# Altium project IOTM222.PrjPcb
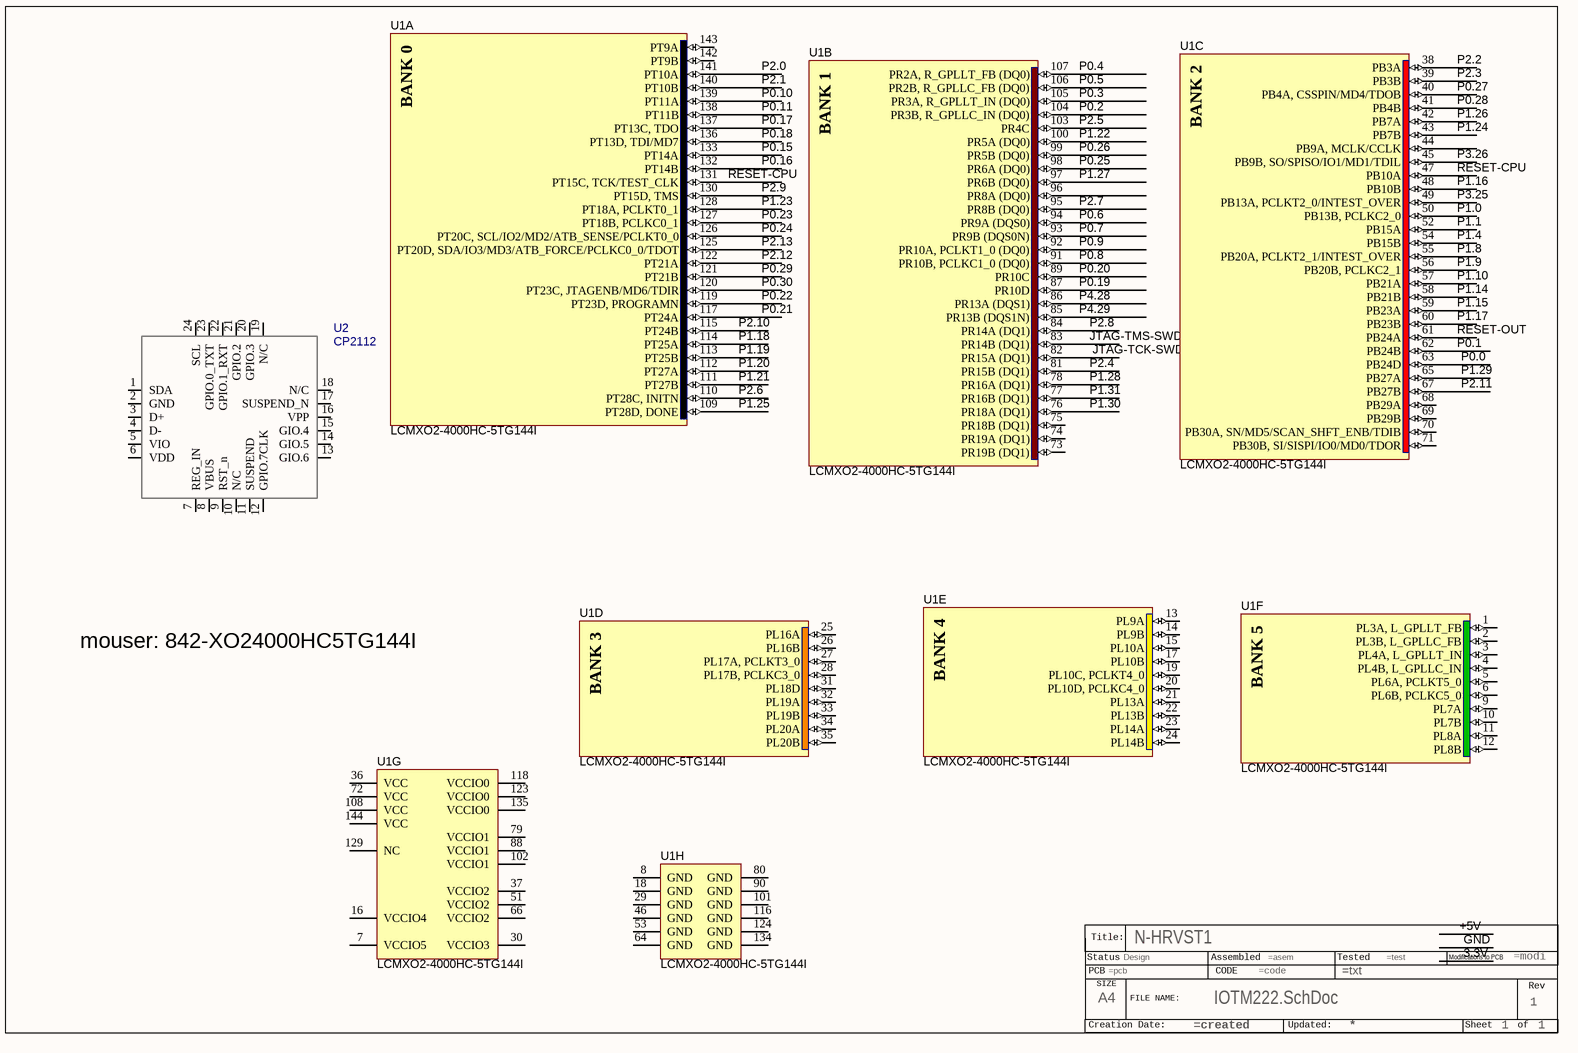
[diagram p0: IOTM222.SchDoc]
prj: N-HRVST1; size: A4; status: Design; ver: 1
2 sheets, 8 parts. Net scope: global (net labels, ports and power ports of the same name join across sheets).
Board file: IOTM222.PcbDoc
Sheets:
  IOTM222.SchDoc
  IOTM-222B.SchDoc

## Sheet IOTM222.SchDoc
size A4; DocumentNumber: 1; SheetNumber: 1; SheetTotal: 1

### Parts
?*  FILE_NAME: IOTM222.SchDoc  PAGE NUMPER: 1  size: A4  pr: N-HRVST1  STATUS: Design  (hidden comment: TITLEBLOCK2)  (graphical)
U1  LCMXO2-4000HC-5TG144I  [TQFP144_N]  (parts A,B,C,D,E,F,G,H of 8)
U2  CP2112  [QFN24]

### Nets
JTAG-TCK-SWDCLK: U1.82(PR15A_(DQ1))
JTAG-TMS-SWDIO: U1.83(PR14B_(DQ1))
P0.0: U1.63(PB24D)
P0.1: U1.62(PB24B)
P0.2: U1.104(PR3B,_R_GPLLC_IN_(DQ0))
P0.3: U1.105(PR3A,_R_GPLLT_IN_(DQ0))
P0.4: U1.107(PR2A,_R_GPLLT_FB_(DQ0))
P0.5: U1.106(PR2B,_R_GPLLC_FB_(DQ0))
P0.6: U1.94(PR9A_(DQS0))
P0.7: U1.93(PR9B_(DQS0N))
P0.8: U1.91(PR10B,_PCLKC1_0_(DQ0))
P0.9: U1.92(PR10A,_PCLKT1_0_(DQ0))
P0.10: U1.139(PT11A)
P0.11: U1.138(PT11B)
P0.15: U1.133(PT14A)
P0.16: U1.132(PT14B)
P0.17: U1.137(PT13C,_TDO)
P0.18: U1.136(PT13D,_TDI/MD7)
P0.19: U1.87(PR10D)
P0.20: U1.89(PR10C)
P0.21: U1.117(PT24A)
P0.22: U1.119(PT23D,_PROGRAMN)
P0.23: U1.127(PT18B,_PCLKC0_1)
P0.24: U1.126(PT20C,_SCL/IO2/MD2/ATB_SENSE/PCLKT0_0)
P0.25: U1.98(PR6A_(DQ0))
P0.26: U1.99(PR5B_(DQ0))
P0.27: U1.40(PB4A,_CSSPIN/MD4/TDOB)
P0.28: U1.41(PB4B)
P0.29: U1.121(PT21B)
P0.30: U1.120(PT23C,_JTAGENB/MD6/TDIR)
P1.0: U1.50(PB13B,_PCLKC2_0)
P1.1: U1.52(PB15A)
P1.4: U1.54(PB15B)
P1.8: U1.55(PB20A,_PCLKT2_1/INTEST_OVER)
P1.9: U1.56(PB20B,_PCLKC2_1)
P1.10: U1.57(PB21A)
P1.14: U1.58(PB21B)
P1.15: U1.59(PB23A)
P1.16: U1.48(PB10B)
P1.17: U1.60(PB23B)
P1.18: U1.114(PT25A)
P1.19: U1.113(PT25B)
P1.20: U1.112(PT27A)
P1.21: U1.111(PT27B)
P1.22: U1.100(PR5A_(DQ0))
P1.23: U1.128(PT18A,_PCLKT0_1)
P1.24: U1.43(PB7B)
P1.25: U1.109(PT28D,_DONE)
P1.26: U1.42(PB7A)
P1.27: U1.97(PR6B_(DQ0))
P1.28: U1.78(PR16A_(DQ1))
P1.29: U1.65(PB27A)
P1.30: U1.76(PR18A_(DQ1))
P1.31: U1.77(PR16B_(DQ1))
P2.0: U1.141(PT10A)
P2.1: U1.140(PT10B)
P2.2: U1.38(PB3A)
P2.3: U1.39(PB3B)
P2.4: U1.81(PR15B_(DQ1))
P2.5: U1.103(PR4C)
P2.6: U1.110(PT28C,_INITN)
P2.7: U1.95(PR8B_(DQ0))
P2.8: U1.84(PR14A_(DQ1))
P2.9: U1.130(PT15D,_TMS)
P2.10: U1.115(PT24B)
P2.11: U1.67(PB27B)
P2.12: U1.122(PT21A)
P2.13: U1.125(PT20D,_SDA/IO3/MD3/ATB_FORCE/PCLKC0_0/TDOT)
P3.25: U1.49(PB13A,_PCLKT2_0/INTEST_OVER)
P3.26: U1.45(PB9B,_SO/SPISO/IO1/MD1/TDIL)
P4.28: U1.86(PR13A_(DQS1))
P4.29: U1.85(PR13B_(DQS1N))
RESET-CPU: U1.47(PB10A) U1.131(PT15C,_TCK/TEST_CLK)
RESET-OUT: U1.61(PB24A)

Not connected (* = marked no-connect by the designer): ?* ?1; U1 1(PL3A,_L_GPLLT_FB) 2(PL3B,_L_GPLLC_FB) 3(PL4A,_L_GPLLT_IN) 4(PL4B,_L_GPLLC_IN) 5(PL6A,_PCLKT5_0) 6(PL6B,_PCLKC5_0) 7(VCCIO5) 8(GND) 9(PL7A) 10(PL7B) 11(PL8A) 12(PL8B) 13(PL9A) 14(PL9B) 15(PL10A) 16(VCCIO4) 17(PL10B) 18(GND) 19(PL10C,_PCLKT4_0) 20(PL10D,_PCLKC4_0) 21(PL13A) 22(PL13B) 23(PL14A) 24(PL14B) 25(PL16A) 26(PL16B) 27(PL17A,_PCLKT3_0) 28(PL17B,_PCLKC3_0) 29(GND) 30(VCCIO3) 31(PL18D) 32(PL19A) 33(PL19B) 34(PL20A) 35(PL20B) 36(VCC) 37(VCCIO2) 44(PB9A,_MCLK/CCLK) 46(GND) 51(VCCIO2) 53(GND) 64(GND) 66(VCCIO2) 68(PB29A) 69(PB29B) 70(PB30A,_SN/MD5/SCAN_SHFT_ENB/TDIB) 71(PB30B,_SI/SISPI/IO0/MD0/TDOR) 72(VCC) 73(PR19B_(DQ1)) 74(PR19A_(DQ1)) 75(PR18B_(DQ1)) 79(VCCIO1) 80(GND) 88(VCCIO1) 90(GND) 96(PR8A_(DQ0)) 101(GND) 102(VCCIO1) 108(VCC) 116(GND) 118(VCCIO0) 123(VCCIO0) 124(GND) 129(NC) 134(GND) 135(VCCIO0) 142(PT9B) 143(PT9A) 144(VCC); U2 1(SDA) 2(GND) 3(D+) 4(D-) 5(VIO) 6(VDD) 7(REG_IN) 8(VBUS) 9(RST_n) 10(N/C) 11(SUSPEND) 12(GPIO.7CLK) 13(GIO.6) 14(GIO.5) 15(GIO.4) 16(VPP) 17(SUSPEND_N) 18(N/C) 19(N/C) 20(GPIO.3) 21(GPIO.2) 22(GPIO.1_RXT) 23(GPIO.0_TXT) 24(SCL)

### Notes on the sheet
- mouser: 842-XO24000HC5TG144I
- (in symbol LCMXO2-4000HC-5TG144I, part A) BANK 0
- (in symbol LCMXO2-4000HC-5TG144I, part B) BANK 1
- (in symbol LCMXO2-4000HC-5TG144I, part C) BANK 2
- (in symbol LCMXO2-4000HC-5TG144I, part D) BANK 3
- (in symbol LCMXO2-4000HC-5TG144I, part E) BANK 4
- (in symbol LCMXO2-4000HC-5TG144I, part F) BANK 5
- (in symbol TITLEBLOCK2) Title:; Status; Assembled; Tested; Modifications to PCB; PCB; CODE; SIZE; Rev; FILE NAME:; Creation Date:; Updated:; Sheet; of

### Library data of the parts
U1 = LCMXO2-4000HC-5TG144I: MachXO2 High Performance CPLD with 4320 LUTs, Voltage Regulator, 2.5V/3.3V, 144-pin TQFP, Speed Grade-5, Industrial Grade, Halogen Free (RoHS); DatasheetVersion: ver01.5, Aug-2011; PackageVersion: ver02.8, Jul-2011; PackageReference: TQFP144; PackageDescription: 144-Pin Thin Quad Flat Pack (TQFP144); Code_JEDEC: MS-026-BFB; ComponentLink1Description: Manufacturer URL; ComponentLink1URL: http://www.latticesemi.com/; ComponentLink2Description: Datasheet; ComponentLink2URL: http://www.latticesemi.com/documents/DS1035.pdf; ComponentLink3Description: Package Specification; ComponentLink3URL: http://www.latticesemi.com/lit/docs/package/pkg.pdf
?* = TITLEBLOCK2: CREATION DATE: =created; UPDATED: *; PAGE COUNT: 1; VERSION: 1; ASSEMBLY: =asem; MODIFICATIONS TO OPERATE: =modi; TESTED: =test; PCB: =pcb; CODE: =code; TEXT: =txt

## Sheet IOTM-222B.SchDoc
size A3
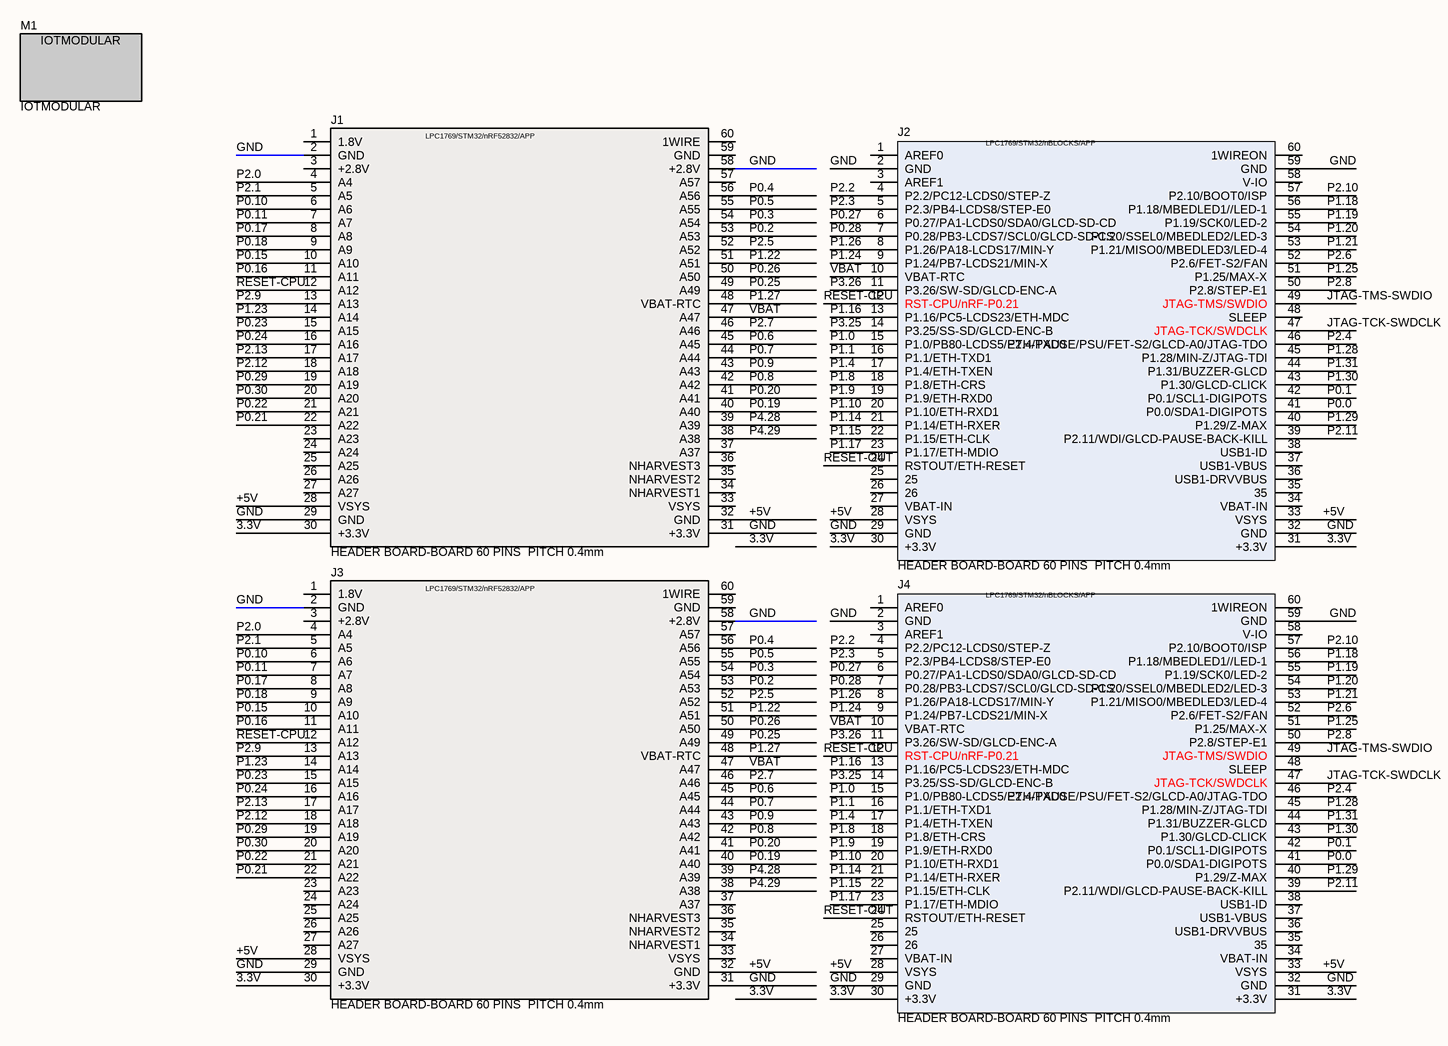
[diagram p1: IOTM-222B.SchDoc]

### Parts
J1  HEADER BOARD-BOARD 60 PINS  PITCH 0.4mm  [IOT-HIROSE-FX6-60S-0.8SV(71)-TOP]
J2  HEADER BOARD-BOARD 60 PINS  PITCH 0.4mm  [IOT-HIROSE-FX6-60P-0.8SV(71)-TOP]
J3  HEADER BOARD-BOARD 60 PINS  PITCH 0.4mm  [IOT-HIROSE-FX6-60P-0.8SV(71)-TOP]
J4  HEADER BOARD-BOARD 60 PINS  PITCH 0.4mm  [IOT-HIROSE-FX6-60S-0.8SV(71)-TOP]
M1  IOTMODULAR  [IOTMODULAR]  (no BOM)

### Nets
3.3V: J1.30(+3.3V) J2.30(+3.3V) J2.31(+3.3V) J3.30(+3.3V) J4.30(+3.3V) J4.31(+3.3V)
+5V: J1.28(VSYS) J1.32(GND) J2.28(VSYS) J2.33(VSYS) J3.28(VSYS) J3.32(GND) J4.28(VSYS) J4.33(VSYS)
GND: J1.2(GND) J1.29(GND) J1.31(+3.3V) J1.58(+2.8V) J2.2(GND) J2.29(GND) J2.32(GND) J2.59(GND) J3.2(GND) J3.29(GND) J3.31(+3.3V) J3.58(+2.8V) J4.2(GND) J4.29(GND) J4.32(GND) J4.59(GND)
JTAG-TCK-SWDCLK: J2.47(JTAG-TCK/SWDCLK) J4.47(JTAG-TCK/SWDCLK)
JTAG-TMS-SWDIO: J2.49(JTAG-TMS/SWDIO) J4.49(JTAG-TMS/SWDIO)
P0.0: J2.41(P0.0/SDA1-DIGIPOTS) J4.41(P0.0/SDA1-DIGIPOTS)
P0.1: J2.42(P0.1/SCL1-DIGIPOTS) J4.42(P0.1/SCL1-DIGIPOTS)
P0.2: J1.53(A53) J3.53(A53)
P0.3: J1.54(A54) J3.54(A54)
P0.4: J1.56(A56) J3.56(A56)
P0.5: J1.55(A55) J3.55(A55)
P0.6: J1.45(A45) J3.45(A45)
P0.7: J1.44(A44) J3.44(A44)
P0.8: J1.42(A42) J3.42(A42)
P0.9: J1.43(A43) J3.43(A43)
P0.10: J1.6(A6) J3.6(A6)
P0.11: J1.7(A7) J3.7(A7)
P0.15: J1.10(A10) J3.10(A10)
P0.16: J1.11(A11) J3.11(A11)
P0.17: J1.8(A8) J3.8(A8)
P0.18: J1.9(A9) J3.9(A9)
P0.19: J1.40(A40) J3.40(A40)
P0.20: J1.41(A41) J3.41(A41)
P0.21: J1.22(A22) J3.22(A22)
P0.22: J1.21(A21) J3.21(A21)
P0.23: J1.15(A15) J3.15(A15)
P0.24: J1.16(A16) J3.16(A16)
P0.25: J1.49(A49) J3.49(A49)
P0.26: J1.50(A50) J3.50(A50)
P0.27: J2.6(P0.27/PA1-LCDS0/SDA0/GLCD-SD-CD) J4.6(P0.27/PA1-LCDS0/SDA0/GLCD-SD-CD)
P0.28: J2.7(P0.28/PB3-LCDS7/SCL0/GLCD-SD-CS) J4.7(P0.28/PB3-LCDS7/SCL0/GLCD-SD-CS)
P0.29: J1.19(A19) J3.19(A19)
P0.30: J1.20(A20) J3.20(A20)
P1.0: J2.15(P1.0/PB80-LCDS5/ETH-TXD0) J4.15(P1.0/PB80-LCDS5/ETH-TXD0)
P1.1: J2.16(P1.1/ETH-TXD1) J4.16(P1.1/ETH-TXD1)
P1.4: J2.17(P1.4/ETH-TXEN) J4.17(P1.4/ETH-TXEN)
P1.8: J2.18(P1.8/ETH-CRS) J4.18(P1.8/ETH-CRS)
P1.9: J2.19(P1.9/ETH-RXD0) J4.19(P1.9/ETH-RXD0)
P1.10: J2.20(P1.10/ETH-RXD1) J4.20(P1.10/ETH-RXD1)
P1.14: J2.21(P1.14/ETH-RXER) J4.21(P1.14/ETH-RXER)
P1.15: J2.22(P1.15/ETH-CLK) J4.22(P1.15/ETH-CLK)
P1.16: J2.13(P1.16/PC5-LCDS23/ETH-MDC) J4.13(P1.16/PC5-LCDS23/ETH-MDC)
P1.17: J2.23(P1.17/ETH-MDIO) J4.23(P1.17/ETH-MDIO)
P1.18: J2.56(P1.18/MBEDLED1//LED-1) J4.56(P1.18/MBEDLED1//LED-1)
P1.19: J2.55(P1.19/SCK0/LED-2) J4.55(P1.19/SCK0/LED-2)
P1.20: J2.54(P1.20/SSEL0/MBEDLED2/LED-3) J4.54(P1.20/SSEL0/MBEDLED2/LED-3)
P1.21: J2.53(P1.21/MISO0/MBEDLED3/LED-4) J4.53(P1.21/MISO0/MBEDLED3/LED-4)
P1.22: J1.51(A51) J3.51(A51)
P1.23: J1.14(A14) J3.14(A14)
P1.24: J2.9(P1.24/PB7-LCDS21/MIN-X) J4.9(P1.24/PB7-LCDS21/MIN-X)
P1.25: J2.51(P1.25/MAX-X) J4.51(P1.25/MAX-X)
P1.26: J2.8(P1.26/PA18-LCDS17/MIN-Y) J4.8(P1.26/PA18-LCDS17/MIN-Y)
P1.27: J1.48(VBAT-RTC) J3.48(VBAT-RTC)
P1.28: J2.45(P1.28/MIN-Z/JTAG-TDI) J4.45(P1.28/MIN-Z/JTAG-TDI)
P1.29: J2.40(P1.29/Z-MAX) J4.40(P1.29/Z-MAX)
P1.30: J2.43(P1.30/GLCD-CLICK) J4.43(P1.30/GLCD-CLICK)
P1.31: J2.44(P1.31/BUZZER-GLCD) J4.44(P1.31/BUZZER-GLCD)
P2.0: J1.4(A4) J3.4(A4)
P2.1: J1.5(A5) J3.5(A5)
P2.2: J2.4(P2.2/PC12-LCDS0/STEP-Z) J4.4(P2.2/PC12-LCDS0/STEP-Z)
P2.3: J2.5(P2.3/PB4-LCDS8/STEP-E0) J4.5(P2.3/PB4-LCDS8/STEP-E0)
P2.4: J2.46(P2.4/PAUSE/PSU/FET-S2/GLCD-A0/JTAG-TDO) J4.46(P2.4/PAUSE/PSU/FET-S2/GLCD-A0/JTAG-TDO)
P2.5: J1.52(A52) J3.52(A52)
P2.6: J2.52(P2.6/FET-S2/FAN) J4.52(P2.6/FET-S2/FAN)
P2.7: J1.46(A46) J3.46(A46)
P2.8: J2.50(P2.8/STEP-E1) J4.50(P2.8/STEP-E1)
P2.9: J1.13(A13) J3.13(A13)
P2.10: J2.57(P2.10/BOOT0/ISP) J4.57(P2.10/BOOT0/ISP)
P2.11: J2.39(P2.11/WDI/GLCD-PAUSE-BACK-KILL) J4.39(P2.11/WDI/GLCD-PAUSE-BACK-KILL)
P2.12: J1.18(A18) J3.18(A18)
P2.13: J1.17(A17) J3.17(A17)
P3.25: J2.14(P3.25/SS-SD/GLCD-ENC-B) J4.14(P3.25/SS-SD/GLCD-ENC-B)
P3.26: J2.11(P3.26/SW-SD/GLCD-ENC-A) J4.11(P3.26/SW-SD/GLCD-ENC-A)
P4.28: J1.39(A39) J3.39(A39)
P4.29: J1.38(A38) J3.38(A38)
RESET-CPU: J1.12(A12) J2.12(RST-CPU/nRF-P0.21) J3.12(A12) J4.12(RST-CPU/nRF-P0.21)
RESET-OUT: J2.24(RSTOUT/ETH-RESET) J4.24(RSTOUT/ETH-RESET)
VBAT: J1.47(A47) J2.10(VBAT-RTC) J3.47(A47) J4.10(VBAT-RTC)

Not connected (* = marked no-connect by the designer): J1 1(1.8V) 3(+2.8V) 23(A23) 24(A24) 25(A25) 26(A26) 27(A27) 33(VSYS) 34(NHARVEST1) 35(NHARVEST2) 36(NHARVEST3) 37(A37) 57(A57) 59(GND) 60(1WIRE); J2 1(AREF0) 3(AREF1) 25 26 27(VBAT-IN) 34(VBAT-IN) 35 36(USB1-DRVVBUS) 37(USB1-VBUS) 38(USB1-ID) 48(SLEEP) 58(V-IO) 60(1WIREON); J3 1(1.8V) 3(+2.8V) 23(A23) 24(A24) 25(A25) 26(A26) 27(A27) 33(VSYS) 34(NHARVEST1) 35(NHARVEST2) 36(NHARVEST3) 37(A37) 57(A57) 59(GND) 60(1WIRE); J4 1(AREF0) 3(AREF1) 25 26 27(VBAT-IN) 34(VBAT-IN) 35 36(USB1-DRVVBUS) 37(USB1-VBUS) 38(USB1-ID) 48(SLEEP) 58(V-IO) 60(1WIREON)

### Notes on the sheet
- (in symbol HEADER 60-NBUS-A) LPC1769/STM32/nRF52832/APP
- (in symbol HEADER 60-NBUS-B) LPC1769/STM32/nBLOCKS/APP

### Library data of the parts
J1 J3 = HEADER 60-NBUS-A: S.Description: CONN RCPT 60POS 0.4MM SMD GOLD; ComponentLink1URL: http://www.molex.com/pdm_docs/sd/5037726010_sd.pdf?src-supplier=Digi-Key; ComponentLink1Description: http://www.molex.com/pdm_docs/sd/5037726010_sd.pdf?src-supplier=Digi-Key
J2 J4 = HEADER 60-NBUS-B

## Nets that join several sheets
JTAG-TCK-SWDCLK: IOTM222 (U1.82), IOTM-222B (J2.47 J4.47)
JTAG-TMS-SWDIO: IOTM222 (U1.83), IOTM-222B (J2.49 J4.49)
P0.0: IOTM222 (U1.63), IOTM-222B (J2.41 J4.41)
P0.1: IOTM222 (U1.62), IOTM-222B (J2.42 J4.42)
P0.2: IOTM222 (U1.104), IOTM-222B (J1.53 J3.53)
P0.3: IOTM222 (U1.105), IOTM-222B (J1.54 J3.54)
P0.4: IOTM222 (U1.107), IOTM-222B (J1.56 J3.56)
P0.5: IOTM222 (U1.106), IOTM-222B (J1.55 J3.55)
P0.6: IOTM222 (U1.94), IOTM-222B (J1.45 J3.45)
P0.7: IOTM222 (U1.93), IOTM-222B (J1.44 J3.44)
P0.8: IOTM222 (U1.91), IOTM-222B (J1.42 J3.42)
P0.9: IOTM222 (U1.92), IOTM-222B (J1.43 J3.43)
P0.10: IOTM222 (U1.139), IOTM-222B (J1.6 J3.6)
P0.11: IOTM222 (U1.138), IOTM-222B (J1.7 J3.7)
P0.15: IOTM222 (U1.133), IOTM-222B (J1.10 J3.10)
P0.16: IOTM222 (U1.132), IOTM-222B (J1.11 J3.11)
P0.17: IOTM222 (U1.137), IOTM-222B (J1.8 J3.8)
P0.18: IOTM222 (U1.136), IOTM-222B (J1.9 J3.9)
P0.19: IOTM222 (U1.87), IOTM-222B (J1.40 J3.40)
P0.20: IOTM222 (U1.89), IOTM-222B (J1.41 J3.41)
P0.21: IOTM222 (U1.117), IOTM-222B (J1.22 J3.22)
P0.22: IOTM222 (U1.119), IOTM-222B (J1.21 J3.21)
P0.23: IOTM222 (U1.127), IOTM-222B (J1.15 J3.15)
P0.24: IOTM222 (U1.126), IOTM-222B (J1.16 J3.16)
P0.25: IOTM222 (U1.98), IOTM-222B (J1.49 J3.49)
P0.26: IOTM222 (U1.99), IOTM-222B (J1.50 J3.50)
P0.27: IOTM222 (U1.40), IOTM-222B (J2.6 J4.6)
P0.28: IOTM222 (U1.41), IOTM-222B (J2.7 J4.7)
P0.29: IOTM222 (U1.121), IOTM-222B (J1.19 J3.19)
P0.30: IOTM222 (U1.120), IOTM-222B (J1.20 J3.20)
P1.0: IOTM222 (U1.50), IOTM-222B (J2.15 J4.15)
P1.1: IOTM222 (U1.52), IOTM-222B (J2.16 J4.16)
P1.4: IOTM222 (U1.54), IOTM-222B (J2.17 J4.17)
P1.8: IOTM222 (U1.55), IOTM-222B (J2.18 J4.18)
P1.9: IOTM222 (U1.56), IOTM-222B (J2.19 J4.19)
P1.10: IOTM222 (U1.57), IOTM-222B (J2.20 J4.20)
P1.14: IOTM222 (U1.58), IOTM-222B (J2.21 J4.21)
P1.15: IOTM222 (U1.59), IOTM-222B (J2.22 J4.22)
P1.16: IOTM222 (U1.48), IOTM-222B (J2.13 J4.13)
P1.17: IOTM222 (U1.60), IOTM-222B (J2.23 J4.23)
P1.18: IOTM222 (U1.114), IOTM-222B (J2.56 J4.56)
P1.19: IOTM222 (U1.113), IOTM-222B (J2.55 J4.55)
P1.20: IOTM222 (U1.112), IOTM-222B (J2.54 J4.54)
P1.21: IOTM222 (U1.111), IOTM-222B (J2.53 J4.53)
P1.22: IOTM222 (U1.100), IOTM-222B (J1.51 J3.51)
P1.23: IOTM222 (U1.128), IOTM-222B (J1.14 J3.14)
P1.24: IOTM222 (U1.43), IOTM-222B (J2.9 J4.9)
P1.25: IOTM222 (U1.109), IOTM-222B (J2.51 J4.51)
P1.26: IOTM222 (U1.42), IOTM-222B (J2.8 J4.8)
P1.27: IOTM222 (U1.97), IOTM-222B (J1.48 J3.48)
P1.28: IOTM222 (U1.78), IOTM-222B (J2.45 J4.45)
P1.29: IOTM222 (U1.65), IOTM-222B (J2.40 J4.40)
P1.30: IOTM222 (U1.76), IOTM-222B (J2.43 J4.43)
P1.31: IOTM222 (U1.77), IOTM-222B (J2.44 J4.44)
P2.0: IOTM222 (U1.141), IOTM-222B (J1.4 J3.4)
P2.1: IOTM222 (U1.140), IOTM-222B (J1.5 J3.5)
P2.2: IOTM222 (U1.38), IOTM-222B (J2.4 J4.4)
P2.3: IOTM222 (U1.39), IOTM-222B (J2.5 J4.5)
P2.4: IOTM222 (U1.81), IOTM-222B (J2.46 J4.46)
P2.5: IOTM222 (U1.103), IOTM-222B (J1.52 J3.52)
P2.6: IOTM222 (U1.110), IOTM-222B (J2.52 J4.52)
P2.7: IOTM222 (U1.95), IOTM-222B (J1.46 J3.46)
P2.8: IOTM222 (U1.84), IOTM-222B (J2.50 J4.50)
P2.9: IOTM222 (U1.130), IOTM-222B (J1.13 J3.13)
P2.10: IOTM222 (U1.115), IOTM-222B (J2.57 J4.57)
P2.11: IOTM222 (U1.67), IOTM-222B (J2.39 J4.39)
P2.12: IOTM222 (U1.122), IOTM-222B (J1.18 J3.18)
P2.13: IOTM222 (U1.125), IOTM-222B (J1.17 J3.17)
P3.25: IOTM222 (U1.49), IOTM-222B (J2.14 J4.14)
P3.26: IOTM222 (U1.45), IOTM-222B (J2.11 J4.11)
P4.28: IOTM222 (U1.86), IOTM-222B (J1.39 J3.39)
P4.29: IOTM222 (U1.85), IOTM-222B (J1.38 J3.38)
RESET-CPU: IOTM222 (U1.47 U1.131), IOTM-222B (J1.12 J2.12 J3.12 J4.12)
RESET-OUT: IOTM222 (U1.61), IOTM-222B (J2.24 J4.24)